# Altium schematic sheet PWM.SchDoc
size A4; SheetNumber: 6; SheetTotal: 10
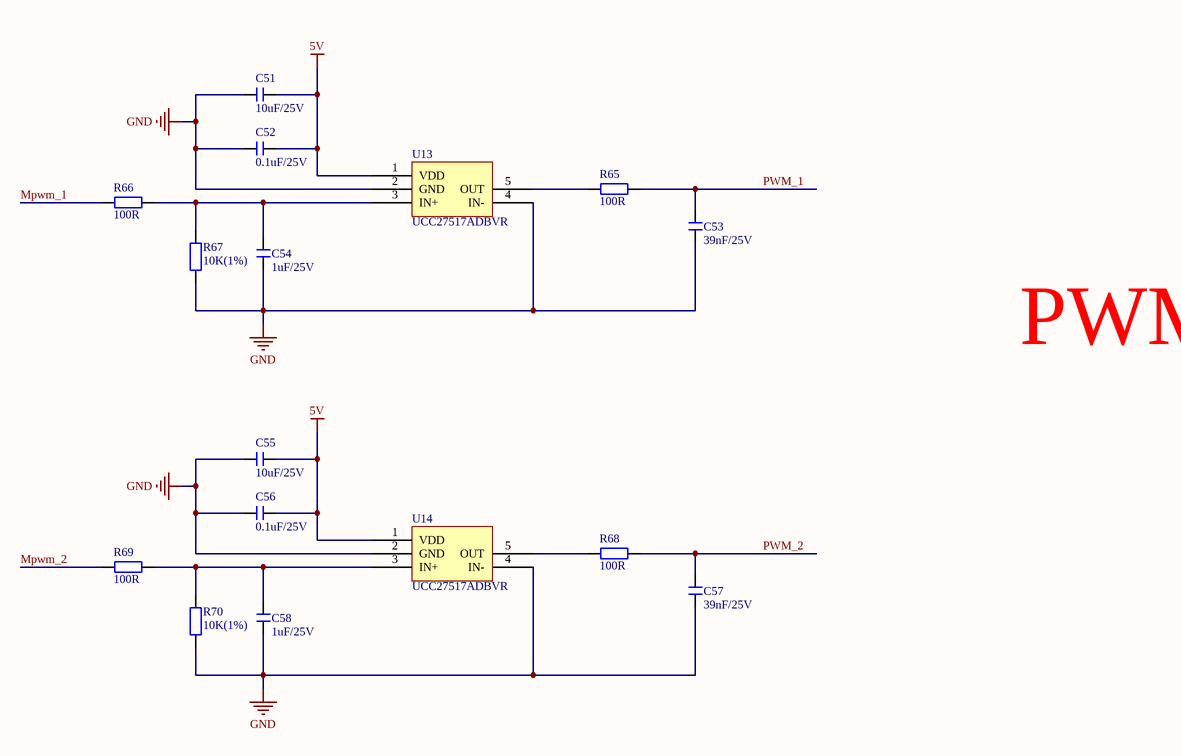
[diagram p0: PWM.SchDoc]

## Parts
C51  10uF/25V  [C 0603_L]
C52  0.1uF/25V  [C 0603_L]
C53  39nF/25V  [C 0603_L]
C54  1uF/25V  [C 0603_L]
C55  10uF/25V  [C 0603_L]
C56  0.1uF/25V  [C 0603_L]
C57  39nF/25V  [C 0603_L]
C58  1uF/25V  [C 0603_L]
R65  100R  [R 0603_L]
R66  100R  [R 0603_L]
R67  10K(1%)  [R 0603_L]
R68  100R  [R 0603_L]
R69  100R  [R 0603_L]
R70  10K(1%)  [R 0603_L]
U13  UCC27517ADBVR  [SOT23-5N]
U14  UCC27517ADBVR  [SOT23-5N]

## Nets
5V: C51.1 C52.1 C55.1 C56.1 U13.1(VDD) U14.1(VDD)
GND: C51.2 C52.2 C53.1 C54.1 C55.2 C56.2 C57.1 C58.1 R67.2 R70.2 U13.2(GND) U13.4(IN-) U14.2(GND) U14.4(IN-)
Mpwm_1: R66.2
Mpwm_2: R69.2
PWM_1: C53.2 R65.1
PWM_2: C57.2 R68.1
NetC54_2: C54.2 R66.1 R67.1 U13.3(IN+)
NetC58_2: C58.2 R69.1 R70.1 U14.3(IN+)
NetR65_2: R65.2 U13.5(OUT)
NetR68_2: R68.2 U14.5(OUT)

## Notes on the sheet
- PWM

## Library data of the parts
C51-C58 = C: 无极性贴片电容; 版权归属: 源创客; BOM名称: 无极性贴片电容; 学习资源: www.ooocke.com
R65-R70 = R: 贴片电阻; 版权归属: 源创客; BOM名称: 贴片电阻; 学习资源: www.ooocke.com